# EAGLE design Sensor LF V.1B (EAGLE 5.06)
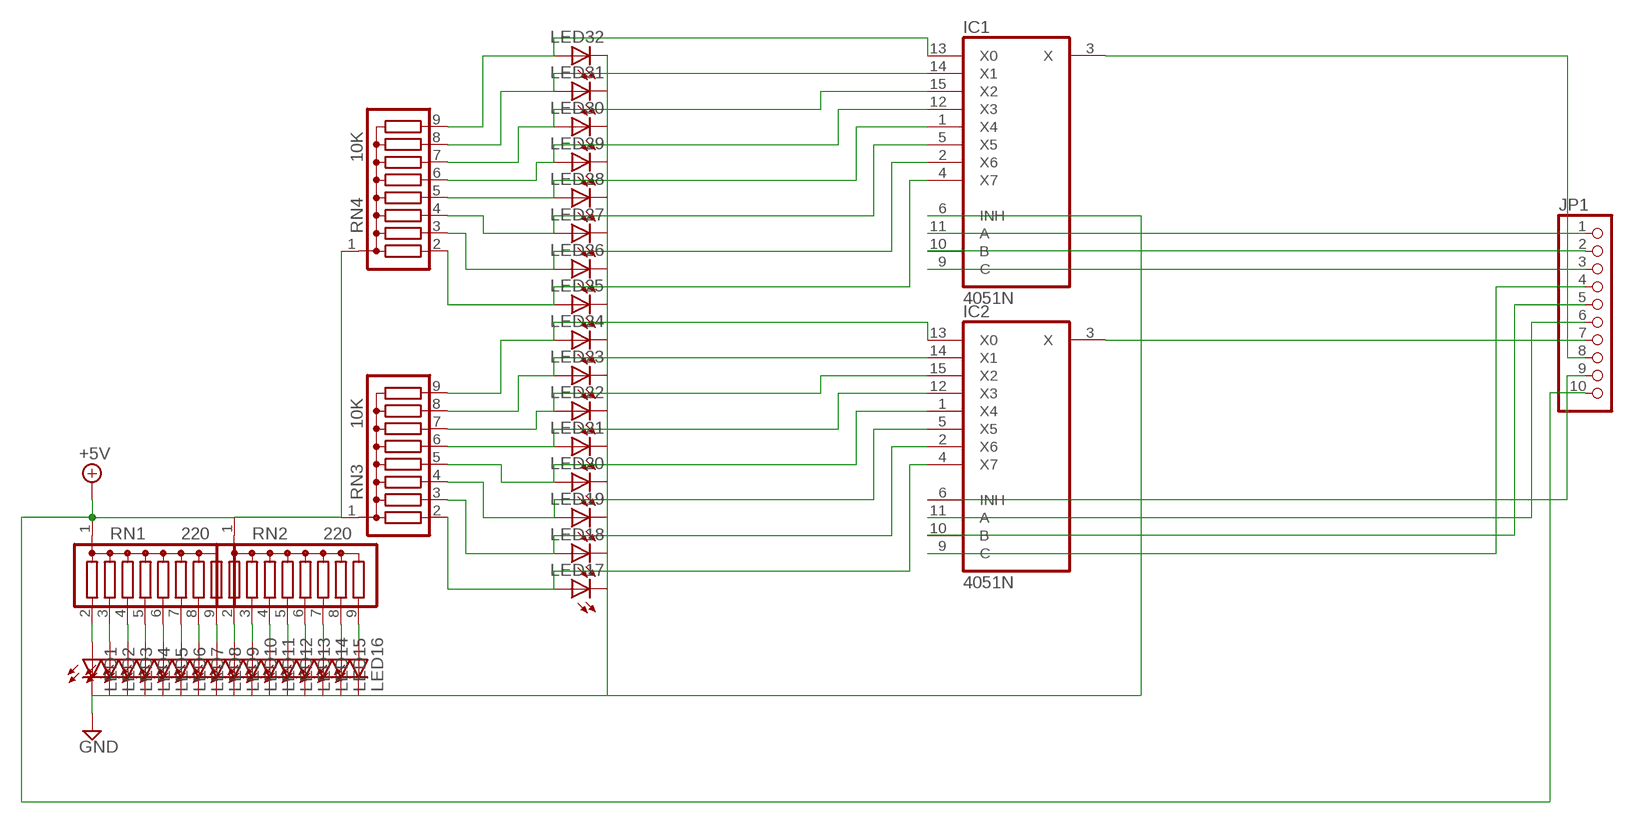
[diagram p0: schematic, sheet 1]

## Parts
IC1  4051N  [DIL16]
IC2  4051N  [DIL16]
JP1  PINHD-1X10  [1X10]
LED1  LED3MM  [LED3MM]
LED2  LED3MM  [LED3MM]
LED3  LED3MM  [LED3MM]
LED4  LED3MM  [LED3MM]
LED5  LED3MM  [LED3MM]
LED6  LED3MM  [LED3MM]
LED7  LED3MM  [LED3MM]
LED8  LED3MM  [LED3MM]
LED9  LED3MM  [LED3MM]
LED10  LED3MM  [LED3MM]
LED11  LED3MM  [LED3MM]
LED12  LED3MM  [LED3MM]
LED13  LED3MM  [LED3MM]
LED14  LED3MM  [LED3MM]
LED15  LED3MM  [LED3MM]
LED16  LED3MM  [LED3MM]
LED17  LED3MM  [LED3MM]
LED18  LED3MM  [LED3MM]
LED19  LED3MM  [LED3MM]
LED20  LED3MM  [LED3MM]
LED21  LED3MM  [LED3MM]
LED22  LED3MM  [LED3MM]
LED23  LED3MM  [LED3MM]
LED24  LED3MM  [LED3MM]
LED25  LED3MM  [LED3MM]
LED26  LED3MM  [LED3MM]
LED27  LED3MM  [LED3MM]
LED28  LED3MM  [LED3MM]
LED29  LED3MM  [LED3MM]
LED30  LED3MM  [LED3MM]
LED31  LED3MM  [LED3MM]
LED32  LED3MM  [LED3MM]
RN1  220  G08R  [SIL9]
RN2  220  G08R  [SIL9]
RN3  10K  G08R  [SIL9]
RN4  10K  G08R  [SIL9]

## Nets
+5V: JP1.10 RN1.1 RN2.1 RN3.1 RN4.1
GND: IC1.6(INH) IC2.6(INH) JP1.9 LED1.K(C) LED2.K(C) LED3.K(C) LED4.K(C) LED5.K(C) LED6.K(C) LED7.K(C) LED8.K(C) LED9.K(C) LED10.K(C) LED11.K(C) LED12.K(C) LED13.K(C) LED14.K(C) LED15.K(C) LED16.K(C) LED17.K(C) LED18.K(C) LED19.K(C) LED20.K(C) LED21.K(C) LED22.K(C) LED23.K(C) LED24.K(C) LED25.K(C) LED26.K(C) LED27.K(C) LED28.K(C) LED29.K(C) LED30.K(C) LED31.K(C) LED32.K(C)
N$1: IC1.10(B) JP1.2
N$2: IC1.9(C) JP1.3
N$3: IC2.11(A) JP1.6
N$4: IC2.10(B) JP1.5
N$5: IC2.9(C) JP1.4
N$6: IC2.3(X) JP1.7
N$15: LED1.A RN1.2
N$16: LED2.A RN1.3
N$17: IC2.4(X7) LED17.A RN3.2
N$18: IC2.2(X6) LED18.A RN3.3
N$19: IC2.5(X5) LED19.A RN3.4
N$20: IC2.1(X4) LED20.A RN3.5
N$21: IC2.12(X3) LED21.A RN3.6
N$22: IC2.15(X2) LED22.A RN3.7
N$23: IC2.14(X1) LED23.A RN3.8
N$24: IC2.13(X0) LED24.A RN3.9
N$25: IC1.4(X7) LED25.A RN4.2
N$26: IC1.2(X6) LED26.A RN4.3
N$27: IC1.5(X5) LED27.A RN4.4
N$28: IC1.1(X4) LED28.A RN4.5
N$29: IC1.12(X3) LED29.A RN4.6
N$30: IC1.15(X2) LED30.A RN4.7
N$31: IC1.14(X1) LED31.A RN4.8
N$32: IC1.13(X0) LED32.A RN4.9
N$33: LED3.A RN1.4
N$34: LED4.A RN1.5
N$35: LED5.A RN1.6
N$36: LED6.A RN1.7
N$37: LED7.A RN1.8
N$38: LED8.A RN1.9
N$39: LED9.A RN2.2
N$40: LED10.A RN2.3
N$41: LED11.A RN2.4
N$42: LED12.A RN2.5
N$43: LED13.A RN2.6
N$44: LED14.A RN2.7
N$45: LED15.A RN2.8
N$46: LED16.A RN2.9
N$47: IC1.3(X) JP1.8
N$49: IC1.11(A) JP1.1

## Power pins joined to a net without a drawn wire
+5V: IC1.16(VCC) IC2.16(VCC)
GND: IC1.8(GND) IC2.8(GND)
VEE: IC1.7(VEE) IC2.7(VEE)

## Library data of the parts
IC1 IC2 = 40xx:4051: 8-channel ANALOG MULTIPLEXER
JP1 = pinhead:PINHD-1X10: PIN HEADER
LED1-LED32 = led:LED: LED OSRAM: - CHIPLED LG R971, LG N971, LY N971, LG Q971, LY Q971, LO R971, LY R971 LH N974, LH R974 LS Q976, LO Q976, LY Q976 LO Q996 - Hyper CHIPLED LW Q18S LB Q993, LB Q99A, LB R99A - SideLED LS A670, LO A670, LY A670, LG A670, LP A670 LB A673, LV A673, LT A673, LW A673 LH A674 LY A675 LS A676, LA A676, LO A676, LY A676, LW A676 LS A679, LY A679, LG A679 - Hyper Micro SIDELED® LS Y876, LA Y876, LO Y876, LY Y876 LT Y87S - SmartLED LW L88C, LW L88S LB L89C, LB L89S, LG L890 LS L89K, LO L89K, LY L89K LS L896, LA L896, LO L896, LY L896 - TOPLED LS T670, LO T670, LY T670, LG T670, LP T670 LSG T670, LSP T670, LSY T670, LOP T670, LYG T670 LG T671, LOG T671, LSG T671 LB T673, LV T673, LT T673, LW T673 LH T674 LS T676, LA T676, LO T676, LY T676, LB T676, LH T676, LSB T676, LW T676 LB T67C, LV T67C, LT T67C, LS T67K, LO T67K, LY T67K, LW E67C LS E67B, LA E67B, LO E67B, LY E67B, LB E67C, LV E67C, LT E67C LW T67C LS T679, LY T679, LG T679 LS T770, LO T770, LY T770, LG T770, LP T770 LB T773, LV T773, LT T773, LW T773 LH T774 LS E675, LA E675, LY E675, LS T675 LS T776, LA T776, LO T776, LY T776, LB T776 LHGB T686 LT T68C, LB T68C - Hyper Mini TOPLED® LB M676 - Mini TOPLED Santana® LG M470 LS M47K, LO M47K, LY M47K Source: http://www.osram.convergy.de LUXEON: - LUMILED® LXK2-PW12-R00, LXK2-PW12-S00, LXK2-PW14-U00, LXK2-PW14-V00 LXK2-PM12-R00, LXK2-PM12-S00, LXK2-PM14-U00 LXK2-PE12-Q00, LXK2-PE12-R00, LXK2-PE12-S00, LXK2-PE14-T00, LXK2-PE14-U00 LXK2-PB12-K00, LXK2-PB12-L00, LXK2-PB12-M00, LXK2-PB14-N00, LXK2-PB14-P00, LXK2-PB14-Q00 LXK2-PR12-L00, LXK2-PR12-M00, LXK2-PR14-Q00, LXK2-PR14-R00 LXK2-PD12-Q00, LXK2-PD12-R00, LXK2-PD12-S00 LXK2-PH12-R00, LXK2-PH12-S00 LXK2-PL12-P00, LXK2-PL12-Q00, LXK2-PL12-R00 Source: www.luxeon.com KINGBRIGHT: KA-3528ASYC Source: www.kingbright.com
RN1-RN4 = resistor-sil:G08R: SIL RESISTOR

## Board
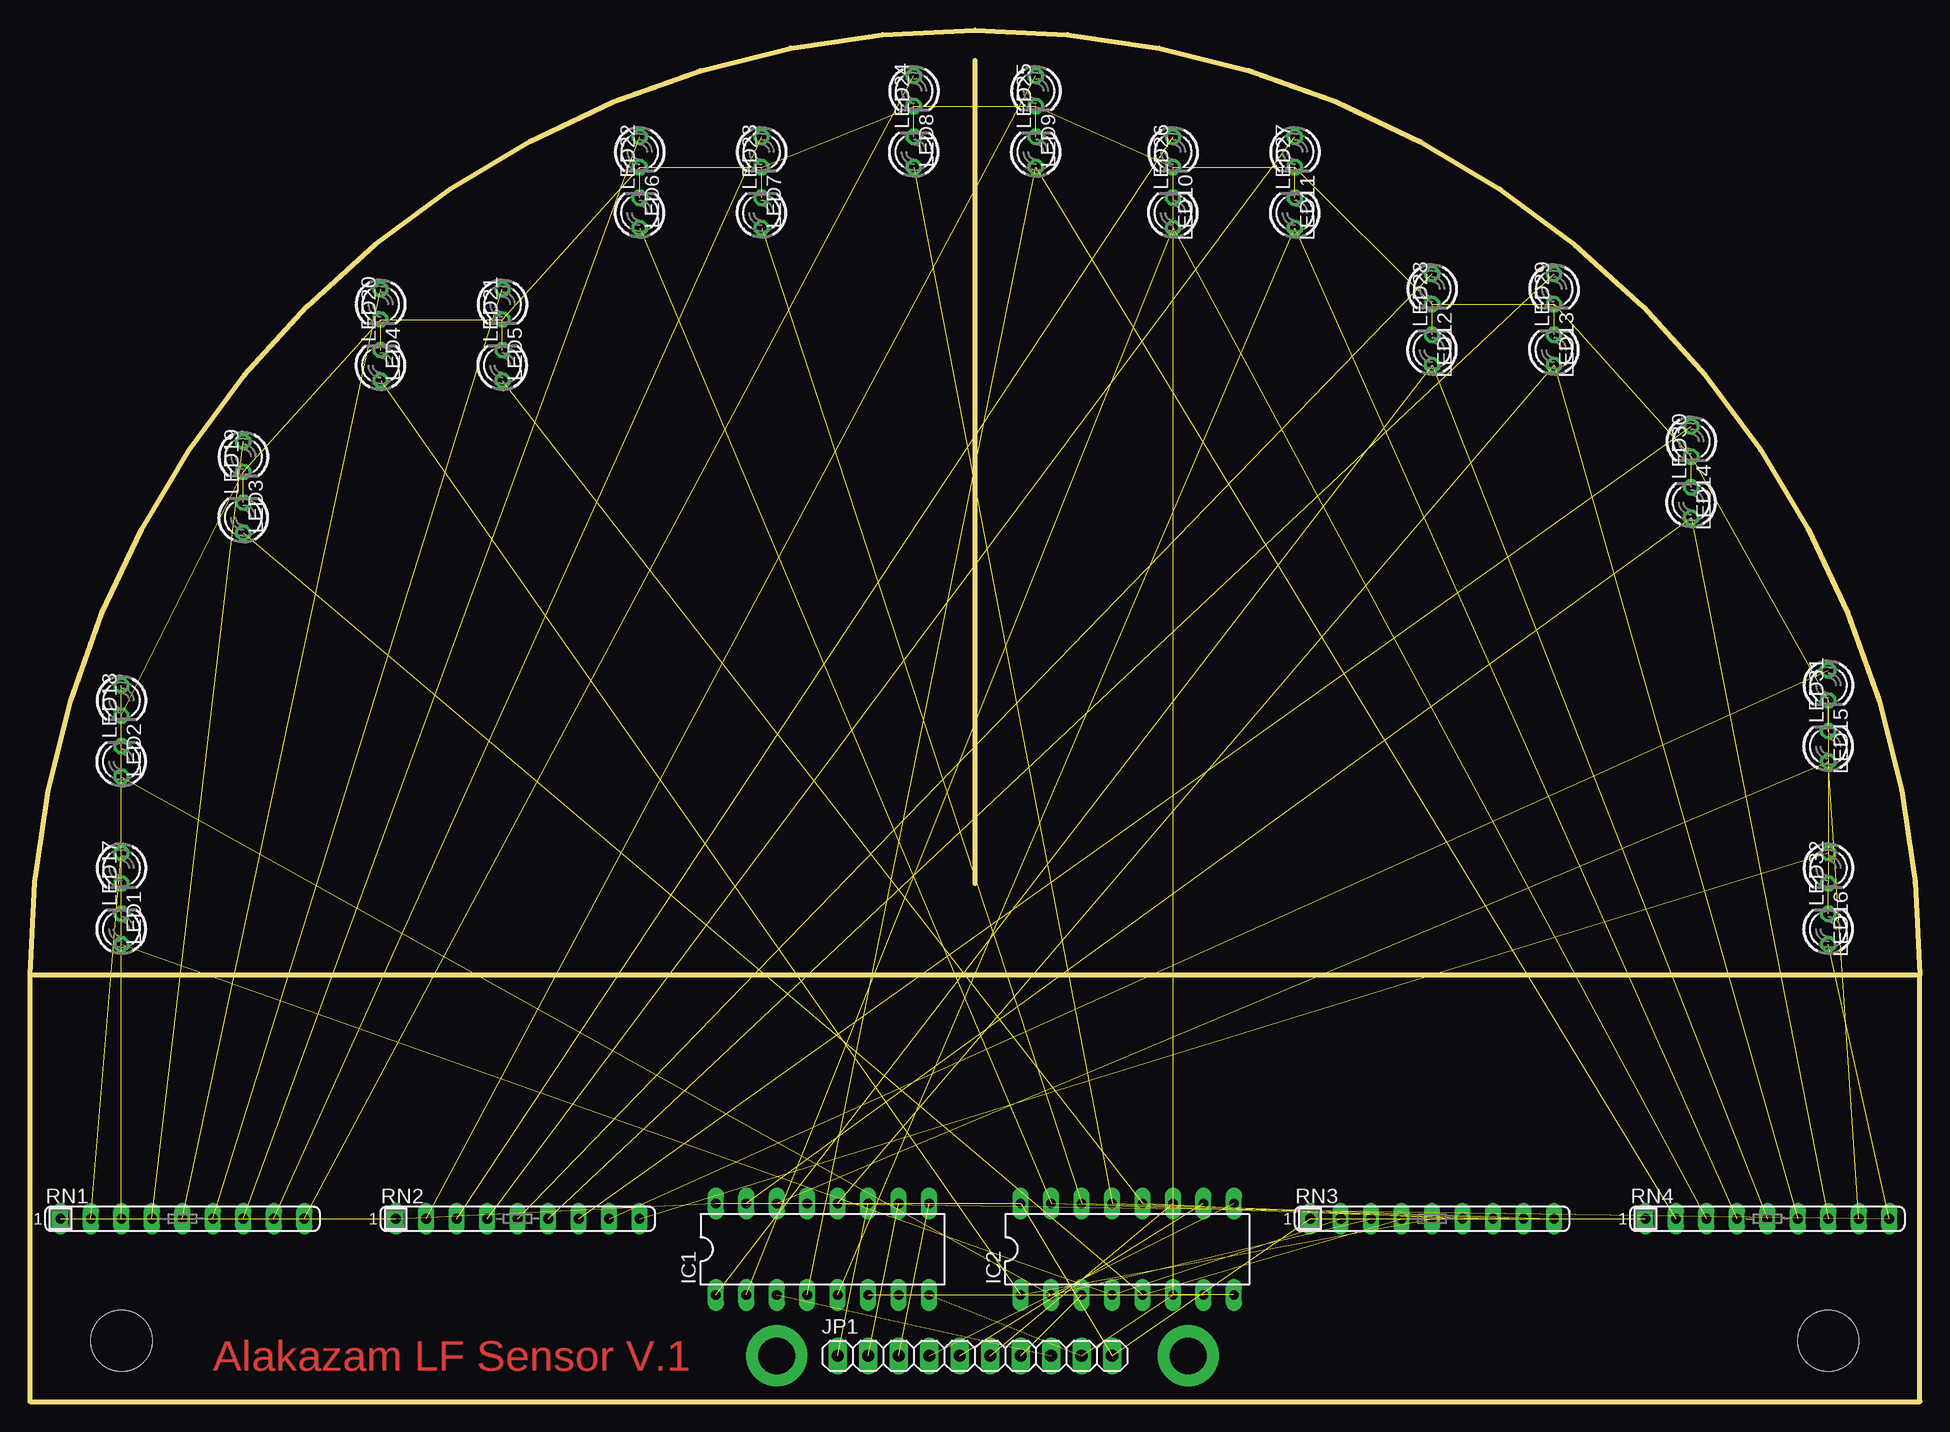
[diagram p1: board, top side]

Size 157.48 x 114.3 mm. Coordinates in mm from the lower left corner, seen from the top.
Outline: 0,35.56 0,0 157.48,0 157.48,35.56
Outline: 0,35.56 157.48,35.56
Outline: 0,35.56 arc-180 157.48,35.56
Outline: 78.74,111.76 78.74,43.18
Copper layers (1*16): Top 0.035mm / dielectric 1.5mm / Bottom 0.035mm
Design rules "default": minimum track width 10mil, minimum drill 24mil, track to track 8mil, track to pad 8mil, pad to pad 8mil, via to via 8mil, smd to smd 8mil, copper to edge 40mil, drill to drill 8mil, minimum pad ring 10mil, minimum via ring 8mil, stop-mask expansion 4mil, vias tented up to drill 0mil, thermal gap 10mil
Holes 5.08 mm at 7.62,5.08 149.86,5.08

### Footprints (pad centres in the part's own frame; a part is rotated, then mirrored left to right if it is on the bottom)
DIL16 = drill 0.813 long: 1 -8.89,-3.81; 2 -6.35,-3.81; 3 -3.81,-3.81; 4 -1.27,-3.81; 5 1.27,-3.81; 6 3.81,-3.81; 7 6.35,-3.81; 8 8.89,-3.81; 9 8.89,3.81; 10 6.35,3.81; 11 3.81,3.81; 12 1.27,3.81; 13 -1.27,3.81; 14 -3.81,3.81; 15 -6.35,3.81; 16 -8.89,3.81
1X10 = drill 1.016 long: 1 -11.43,0; 2 -8.89,0; 3 -6.35,0; 4 -3.81,0; 5 -1.27,0; 6 1.27,0; 7 3.81,0; 8 6.35,0; 9 8.89,0; 10 11.43,0
LED3MM = drill 0.813 octagon: A -1.27,0; K 1.27,0
SIL9 = drill 0.813 long: 1 -10.16,0; 2 -7.62,0; 3 -5.08,0; 4 -2.54,0; 5 0,0; 6 2.54,0; 7 5.08,0; 8 7.62,0; 9 10.16,0

### Placement (x,y rotation side)
IC1  66.04,12.7 0 top
IC2  91.44,12.7 0 top
JP1  78.74,3.81 0 top
LED1  7.62,44.45 270 top
LED2  7.62,58.42 270 top
LED3  17.78,78.74 270 top
LED4  29.21,91.44 270 top
LED5  39.37,91.44 270 top
LED6  50.8,104.14 270 top
LED7  60.96,104.14 270 top
LED8  73.66,109.22 270 top
LED9  83.82,109.22 270 top
LED10  95.25,104.14 270 top
LED11  105.41,104.14 270 top
LED12  116.84,92.71 270 top
LED13  127,92.71 270 top
LED14  138.43,80.01 270 top
LED15  149.86,59.69 270 top
LED16  149.86,44.45 270 top
LED17  7.62,39.37 90 top
LED18  7.62,53.34 90 top
LED19  17.78,73.66 90 top
LED20  29.21,86.36 90 top
LED21  39.37,86.36 90 top
LED22  50.8,99.06 90 top
LED23  60.96,99.06 90 top
LED24  73.66,104.14 90 top
LED25  83.82,104.14 90 top
LED26  95.25,99.06 90 top
LED27  105.41,99.06 90 top
LED28  116.84,87.63 90 top
LED29  127,87.63 90 top
LED30  138.43,74.93 90 top
LED31  149.86,54.61 90 top
LED32  149.86,39.37 90 top
RN1  12.7,15.24 0 top
RN2  40.64,15.24 0 top
RN3  116.84,15.24 0 top
RN4  144.78,15.24 0 top

### Tracks (layer width: path | path; a pad name or v marks a point on that pad's centre or on a via)
+5V  (6 unrouted)
GND  (36 unrouted)
N$1  (1 unrouted)
N$2  (1 unrouted)
N$3  (1 unrouted)
N$4  (1 unrouted)
N$5  (1 unrouted)
N$6  (1 unrouted)
N$7  (via drill 3.05 pad 5.08)
  other vias: 62.23,3.81
N$8  (via drill 3.05 pad 5.08)
  other vias: 96.52,3.81
N$15  (1 unrouted)
N$16  (1 unrouted)
N$17  (2 unrouted)
N$18  (2 unrouted)
N$19  (2 unrouted)
N$20  (2 unrouted)
N$21  (2 unrouted)
N$22  (2 unrouted)
N$23  (2 unrouted)
N$24  (2 unrouted)
N$25  (2 unrouted)
N$26  (2 unrouted)
N$27  (2 unrouted)
N$28  (2 unrouted)
N$29  (2 unrouted)
N$30  (2 unrouted)
N$31  (2 unrouted)
N$32  (2 unrouted)
N$33  (1 unrouted)
N$34  (1 unrouted)
N$35  (1 unrouted)
N$36  (1 unrouted)
N$37  (1 unrouted)
N$38  (1 unrouted)
N$39  (1 unrouted)
N$40  (1 unrouted)
N$41  (1 unrouted)
N$42  (1 unrouted)
N$43  (1 unrouted)
N$44  (1 unrouted)
N$45  (1 unrouted)
N$46  (1 unrouted)
N$47  (1 unrouted)
N$49  (1 unrouted)
VEE  (1 unrouted)

### Text on the board
Top: Alakazam LF Sensor V.1